# EAGLE design treat-dispenser (EAGLE 7.4.0)
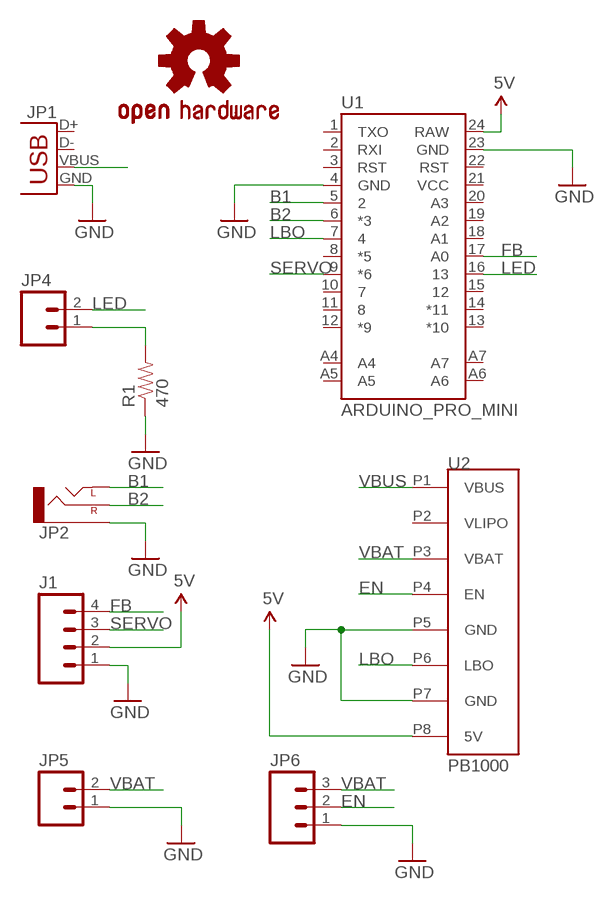
[diagram p0: schematic, sheet 1]

## Parts
J1  M04PTH  [1X04]
JP1  USB-MB-H  [USB-MB-H]
JP2  AUDIO-JACKPTH  [AUDIO-JACK]
JP4  M02PTH  [1X02]
JP5  M02JST-PTH-2  [JST-2-PTH]
JP6  M03PTH  [1X03]
LOGO1  OSHW-LOGOS  [OSHW-LOGO-S]
R1  470  RESISTORPTH-1/4W  [AXIAL-0.4]
U1  ARDUINO_PRO_MINI  [ARDUINO_PRO_MINI]
U2  PB1000  [PB1000]

## Nets
5V: J1.2 U1.24(RAW) U2.P8(5V)
B1: JP2.TIP(LEFT) U1.5
B2: JP2.RING(RIGHT) U1.6(*3)
EN: JP6.2 U2.P4(EN)
FB: J1.4 U1.17(A0)
GND [vcc]: J1.1 JP1.GND JP2.SLEEVE JP5.1 JP6.1 R1.P$1 U1.4(GND) U1.23(GND) U2.P5(GND) U2.P7(GND)
LBO: U1.7 U2.P6(LBO)
LED: JP4.2 U1.16
N$5: JP4.1 R1.P$2
SERVO: J1.3 U1.9(*6)
VBAT: JP5.2 JP6.3 U2.P3(VBAT)
VBUS: JP1.VBUS U2.P1(VBUS)
Unconnected: JP1.D+ JP1.D- U1.1(TXO) U1.2(RXI) U1.3(RST) U1.8(*5) U1.10 U1.11 U1.12(*9) U1.13(*10) U1.14(*11) U1.15 U1.18(A1) U1.19(A2) U1.20(A3) U1.21(VCC) U1.22(RST) U1.A4 U1.A5 U1.A6 U1.A7 U2.P2(VLIPO)

## Library data of the parts
J1 = SparkFun-Connectors:M04: Header 4 Standard 4-pin 0.1" header. Use with straight break away headers (SKU : PRT-00116), right angle break away headers (PRT-00553), swiss pins (PRT-00743), machine pins (PRT-00117), and female headers (PRT-00115). Molex polarized connector foot print use with SKU : PRT-08231 with associated crimp pins and housings. 1MM SMD Version SKU: PRT-10208; PROD_ID: CONN-09696
JP1 = SparkFun-Connectors:USB: USB Connectors USB-B-PTH is fully proven SKU : PRT-00139/CONN-08278 USB-miniB is fully proven SKU : PRT-00587 USB-A-PCB is untested. USB-A-H is throughly reviewed, but untested. Spark Fun Electronics SKU : PRT-00437 USB-B-SMT is throughly reviewed, but untested. Needs silkscreen touching up. USB-A-S has not been used/tested USB-MB-H has not been used/tested USB-MICROB has been used. CONN-09505; PN: WM17115-ND
JP2 = SparkFun-Connectors:AUDIO-JACK: 3.5mm Audio Jack Simple 3.5mm common PCB mount audio jack. Variant PTH is our storefront SKU PRT-08032; PN: CP1-3523N-ND
JP4 = SparkFun-Connectors:M02: Standard 2-pin 0.1" header. Use with - straight break away headers ( PRT-00116) - right angle break away headers (PRT-00553) - swiss pins (PRT-00743) - machine pins (PRT-00117) - female headers (PRT-00115) Molex polarized connector foot print use with: PRT-08233 with associated crimp pins and housings. 2.54_SCREWTERM for use with PRT-10571. 3.5mm Screw Terminal footprints for PRT-08084 5mm Screw Terminal footprints for use with PRT-08432; PN: 952-1311-ND
JP5 = SparkFun-Connectors:M02: Standard 2-pin 0.1" header. Use with - straight break away headers ( PRT-00116) - right angle break away headers (PRT-00553) - swiss pins (PRT-00743) - machine pins (PRT-00117) - female headers (PRT-00115) Molex polarized connector foot print use with: PRT-08233 with associated crimp pins and housings. 2.54_SCREWTERM for use with PRT-10571. 3.5mm Screw Terminal footprints for PRT-08084 5mm Screw Terminal footprints for use with PRT-08432; PN: 455-1719-ND; PROD_ID: CONN-09863; SKU: PRT-09914
JP6 = SparkFun-Connectors:M03: Header 3 Standard 3-pin 0.1" header. Use with straight break away headers (SKU : PRT-00116), right angle break away headers (PRT-00553), swiss pins (PRT-00743), machine pins (PRT-00117), and female headers (PRT-00115). Molex polarized connector foot print use with SKU : PRT-08232 with associated crimp pins and housings.; PN: EG1903-ND
LOGO1 = SparkFun-Aesthetics:OSHW-LOGO: Open Source Hardware Logo This logo indicates the piece of hardware it is found on incorporates a OSHW license and/or adheres to the definition of open source hardware found here: http://freedomdefined.org/OSHW
R1 = SparkFun:RESISTOR: Resistor Basic schematic elements and footprints for 0603, 1206, and PTH resistors.; PN: CF14JT470RCT-ND
U1 = SparkFun-Boards:ARDUINO_PRO_MINI; PN: 1568-1055-ND
U2 = powerboost:PB1000; PN: 1528-1349-ND

## Net classes
0 default: width 0.152 mm, drill 0.305 mm, clearance 0.152 mm

## Board
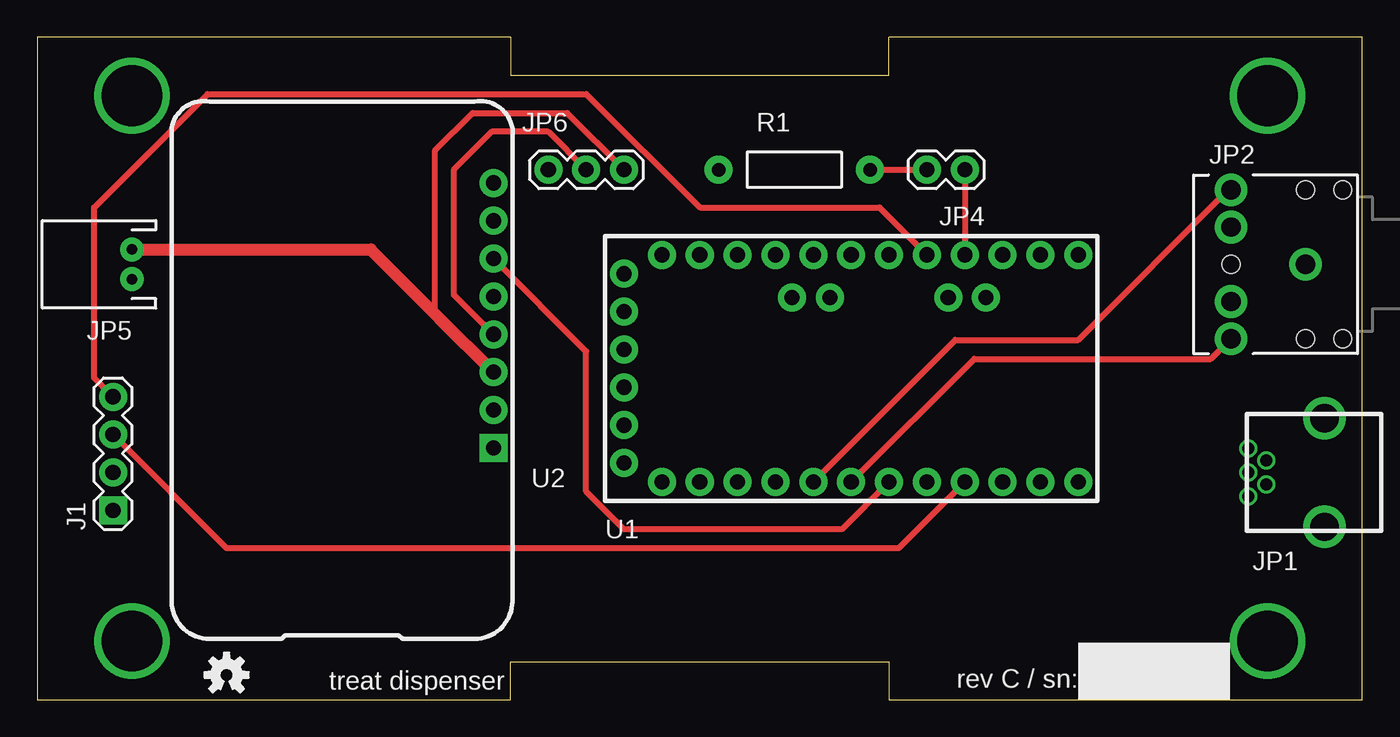
[diagram p1: board, top side]
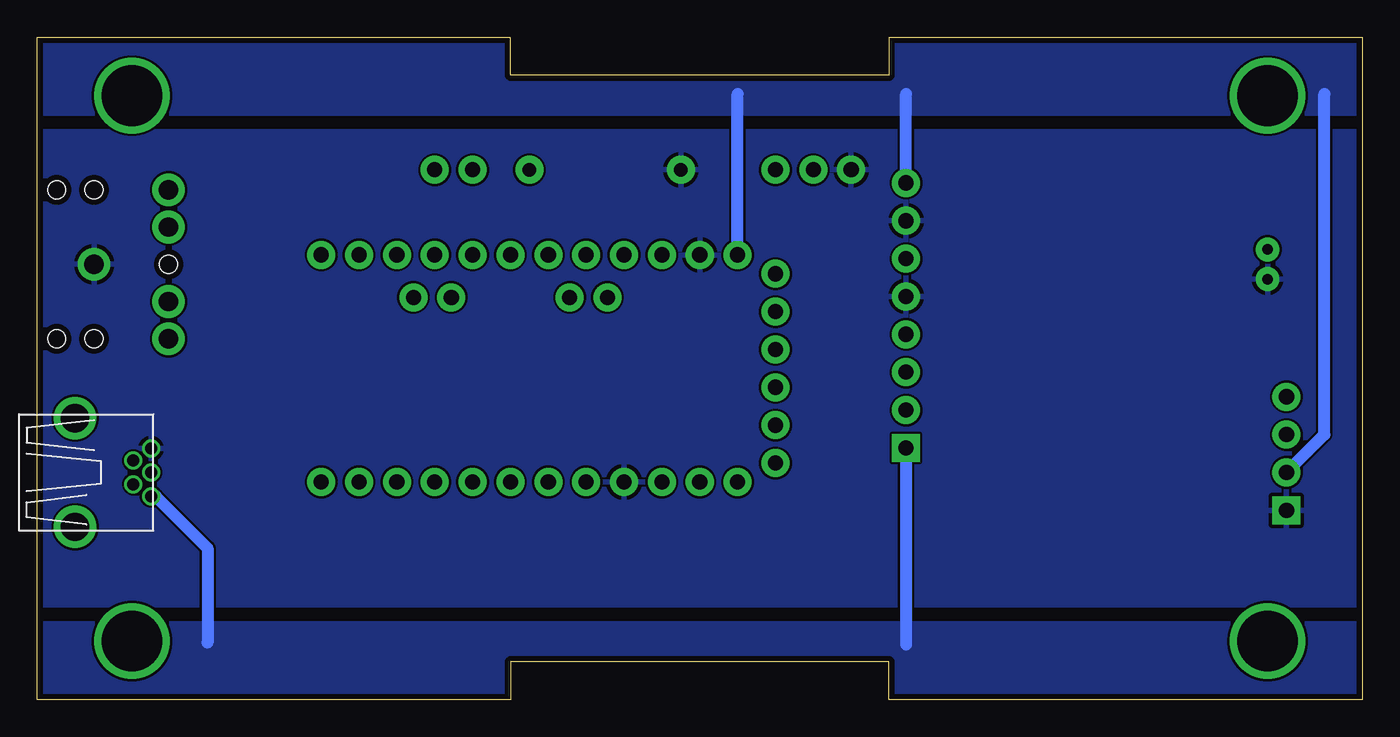
[diagram p2: board, bottom side, seen from below]

Size 88.9 x 44.45 mm. Coordinates in mm from the lower left corner, seen from the top.
Outline: 0,0 31.75,0 31.75,2.54 57.15,2.54 57.15,0 88.9,0 88.9,44.45 57.15,44.45 57.15,41.91 31.75,41.91 31.75,44.45 0,44.45 0,0
Copper layers (1*16): Top 0.0356mm / dielectric 1.5011mm / Bottom 0.0356mm
Design rules "LaenPCBOrder": minimum track width 6mil, minimum drill 13mil, track to track 6mil, track to pad 6mil, pad to pad 6mil, via to via 6mil, smd to smd 6mil, copper to edge 15mil, drill to drill 6mil, minimum pad ring 7mil, minimum via ring 7mil, stop-mask expansion 3mil, vias tented up to drill 0mil, thermal gap 10mil
bKeepout: area 11.9,-3.3 to 77,47.8

### Footprints (pad centres in the part's own frame; a part is rotated, then mirrored left to right if it is on the bottom)
1X04 = drill 1.016 pad 1.88 square: 1 0,0 | drill 1.016 pad 1.88: 2 2.54,0; 3 5.08,0; 4 7.62,0
USB-MB-H = drill 0.8: D+ 5.1,0; D- 3.9,0.8; GND 5.1,-1.6; ID 3.9,-0.8; VBUS 5.1,1.6 | drill 1.9: P$6 0,-3.65; P$7 0,3.65
AUDIO-JACK = drill 1.3 pad 2.184: RING 5,5; RSH 5,2.5; SLEEVE 0,0; TIP 5,-5; TSH 5,-2.5 | hole 1.2: 0,5; -2.5,5; -2.5,-5; 0,-5; 5,0
1X02 = drill 1.016 pad 1.88: 1 0,0; 2 2.54,0
JST-2-PTH = drill 0.7 pad 1.6: 1 -1,0; 2 1,0
1X03 = drill 1.016 pad 1.88: 1 0,0; 2 2.54,0; 3 5.08,0
AXIAL-0.4 = drill 0.9 pad 1.88: P$1 -5.08,0; P$2 5.08,0
ARDUINO_PRO_MINI = drill 1.016 pad 1.88: 1 -7.62,12.7; 2 -7.62,10.16; 3 -7.62,7.62; 4 -7.62,5.08; 5 -7.62,2.54; 6 -7.62,0; 7 -7.62,-2.54; 8 -7.62,-5.08; 9 -7.62,-7.62; 10 -7.62,-10.16; 11 -7.62,-12.7; 12 -7.62,-15.24; 13 7.62,-15.24; 14 7.62,-12.7; 15 7.62,-10.16; 16 7.62,-7.62; 17 7.62,-5.08; 18 7.62,-2.54; 19 7.62,0; 20 7.62,2.54; 21 7.62,5.08; 22 7.62,7.62; 23 7.62,10.16; 24 7.62,12.7; A4 4.763,1.429; A5 4.763,3.969; A6 4.763,-9.049; A7 4.763,-6.509; BLK -6.35,15.24; GND -3.81,15.24; GRN 6.35,15.24; RXI 1.27,15.24; TXO 3.81,15.24; VCC -1.27,15.24
PB1000 = drill 1.016 pad 1.88 square: P1 12.827,1.27 | drill 1.016 pad 1.88: P2 15.367,1.27; P3 17.907,1.27; P4 20.447,1.27; P5 22.987,1.27; P6 25.527,1.27; P7 28.067,1.27; P8 30.607,1.27

### Placement (x,y rotation side)
J1  5.08,12.7 90 top
JP1  86.36,15.24 180 top
JP2  85.09,29.21 180 top
JP4  59.69,35.56 0 top
JP5  6.35,29.21 90 top
JP6  34.29,35.56 0 top
LOGO1  12.7,1.65 0 top
R1  50.8,35.56 0 top
U1  54.61,22.23 90 top
U2  31.88,4.06 90 top

### Tracks (layer width: path | path; a pad name or v marks a point on that pad's centre or on a via)
5V
  Bottom 0.813: U1.24 41.91,40.64 | U2.P8 30.61,40.64 | J1.2 2.54,17.78 2.54,40.64
  pour Bottom: -1.27,45.72 90.17,45.72 90.17,39.37 -1.27,39.37
B1
  Top 0.406: JP2.TIP 79.93,34.21 69.85,24.13 61.59,24.13 U1.5
B2
  Top 0.406: JP2.RING 78.74,22.86 62.87,22.86 U1.6
EN
  Top 0.406: U2.P4 27.94,27.18 27.94,35.56 30.48,38.1 34.29,38.1 JP6.2
FB
  Top 0.406: U1.17 56.52,33.02 44.45,33.02 36.83,40.64 11.43,40.64 3.81,33.02 3.81,21.59 J1.4
GND
  pour Bottom: -1.27,6.35 90.17,6.35 90.17,38.1 -1.27,38.1
LBO
  Top 0.406: U1.7 53.98,11.43 39.37,11.43 36.83,13.97 36.83,23.37 U2.P6
LED
  Top 0.406: JP4.2 U1.16
N$1  (via drill 4.06)
  other vias: 6.35,40.53
N$2  (via drill 4.06)
  other vias: 82.55,40.53
N$3  (via drill 4.06)
  other vias: 82.55,3.92
N$4  (via drill 4.06)
  other vias: 6.35,3.92
N$5
  Top 0.406: R1.P$2 JP4.1
SERVO
  Top 0.406: U1.9 57.78,10.16 12.7,10.16 J1.3
VBAT
  Top 0.406: 26.92,25.65 26.67,25.91 26.67,36.83 29.21,39.37 35.56,39.37 JP6.3
  Top 0.813: JP5.2 22.37,30.21 26.92,25.65 U2.P3
VBUS
  Bottom 0.813: U2.P1 30.61,3.68 | JP1.VBUS 80.95,13.64 77.47,10.16 77.47,3.81
  pour Bottom: -1.27,5.08 -1.27,-1.27 90.17,-1.27 90.17,5.08

### Text on the board
tPlace: treat dispenser | rev C / sn: